# Altium schematic sheet subckt_LNA_HMC1049LP5E.SchDoc: LNA_HMC1049LP5E
size A3; DocumentNumber: 13; Revision: 0; SheetNumber: 13; SheetTotal: 19
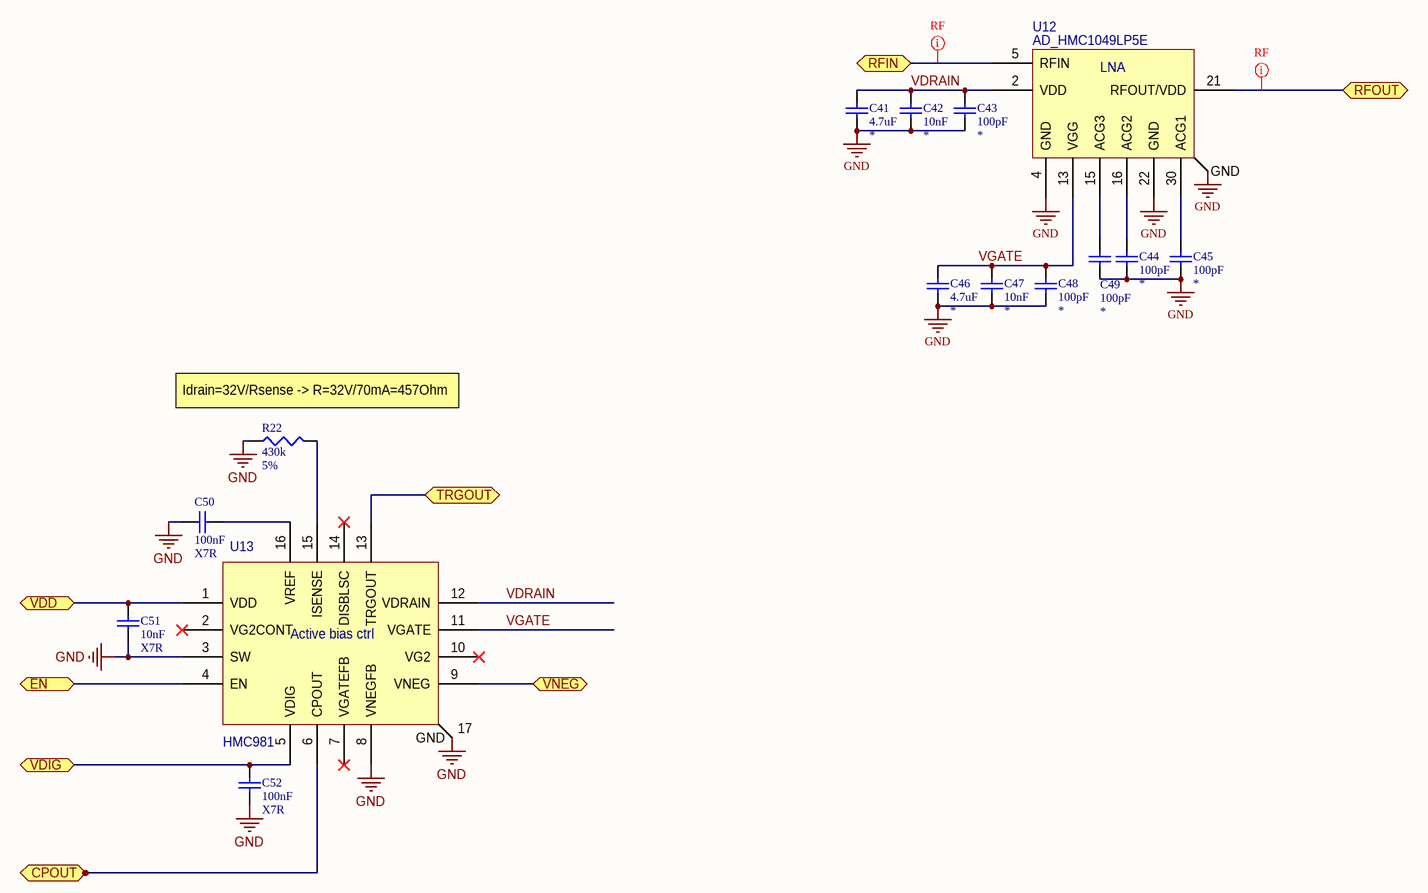
[diagram p0: subckt_LNA_HMC1049LP5E.SchDoc]

## Parts
C41  value 4.7uF  [TBD]  (hidden comment: Capacitor)
C42  value 10nF  [TBD]  (hidden comment: Capacitor)
C43  value 100pF  [TBD]  (hidden comment: Capacitor)
C44  value 100pF  [TBD]  (hidden comment: Capacitor)
C45  value 100pF  [TBD]  (hidden comment: Capacitor)
C46  value 4.7uF  [TBD]  (hidden comment: Capacitor)
C47  value 10nF  [TBD]  (hidden comment: Capacitor)
C48  value 100pF  [TBD]  (hidden comment: Capacitor)
C49  value 100pF  [TBD]  (hidden comment: Capacitor)
C50  value 100nF  Dielectric: X7R  [CAP0603]  (hidden comment: Capacitor)
C51  value 10nF  Dielectric: X7R  [CAP0603]  (hidden comment: Capacitor)
C52  value 100nF  Dielectric: X7R  [CAP0603]  (hidden comment: Capacitor)
R22  value 430k  Type: 5%  [RES0603]  (hidden comment: Resistor)
U12  AD_HMC1049LP5E
U13  HMC981

## Ports
CPOUT, EN, RFIN, RFOUT, TRGOUT, VDD, VDIG, VNEG

## Nets
GND: C41.1 C42.1 C43.1 C44.1 C45.1 C46.1 C47.1 C48.1 C49.1 C50.1 C51.1 C52.1 R22.1 U12.1(NC) U12.3(NC) U12.4(GND) U12.6(NC) U12.7(NC) U12.8(NC) U12.9(NC) U12.10(NC) U12.11(NC) U12.12(NC) U12.14(NC) U12.17(NC) U12.18(NC) U12.19(NC) U12.20(NC) U12.22(GND) U12.23(NC) U12.24(NC) U12.25(NC) U12.26(NC) U12.27(NC) U12.28(NC) U12.29(NC) U12.31(NC) U12.32(NC) U12.33(GND) U13.3(SW) U13.8(VNEGFB) U13.17(GND)
CPOUT: U13.6(CPOUT) ; port CPOUT
EN: U13.4(EN) ; port EN
RFIN: U12.5(RFIN) ; port RFIN
RFOUT: U12.21(RFOUT/VDD) ; port RFOUT
TRGOUT: U13.13(TRGOUT) ; port TRGOUT
VDD: C51.2 U13.1(VDD) ; port VDD
VDIG: C52.2 U13.5(VDIG) ; port VDIG
VDRAIN: C41.2 C42.2 C43.2 U12.2(VDD) U13.12(VDRAIN)
VGATE: C46.2 C47.2 C48.2 U12.13(VGG) U13.11(VGATE)
VNEG: U13.9(VNEG) ; port VNEG
NetC44_2: C44.2 U12.16(ACG2)
NetC45_2: C45.2 U12.30(ACG1)
NetC49_2: C49.2 U12.15(ACG3)
NetC50_2: C50.2 U13.16(VREF)
NetR22_2: R22.2 U13.15(ISENSE)

Not connected (* = marked no-connect by the designer): U13 2(VG2CONT)* 7(VGATEFB)* 10(VG2)* 14(DISBLSC)*

## Layout directives
net class RF: RFIN, RFOUT

## Notes on the sheet
- (near R22) Idrain=32V/Rsense -> R=32V/70mA=457Ohm
- (in symbol AD_HMC981LP3E) Active bias ctrl
- (in symbol AD_HMC1049LP5E) LNA

## Library data of the parts
U12 = AD_HMC1049LP5E: AD 0.3GHz-20GHz LNA
U13 = AD_HMC981LP3E: HMC981LP3E active bias controller for LNA's w/ external Vgg control
C41-C52 = Capacitor
  C41-C49: Dielectric: *